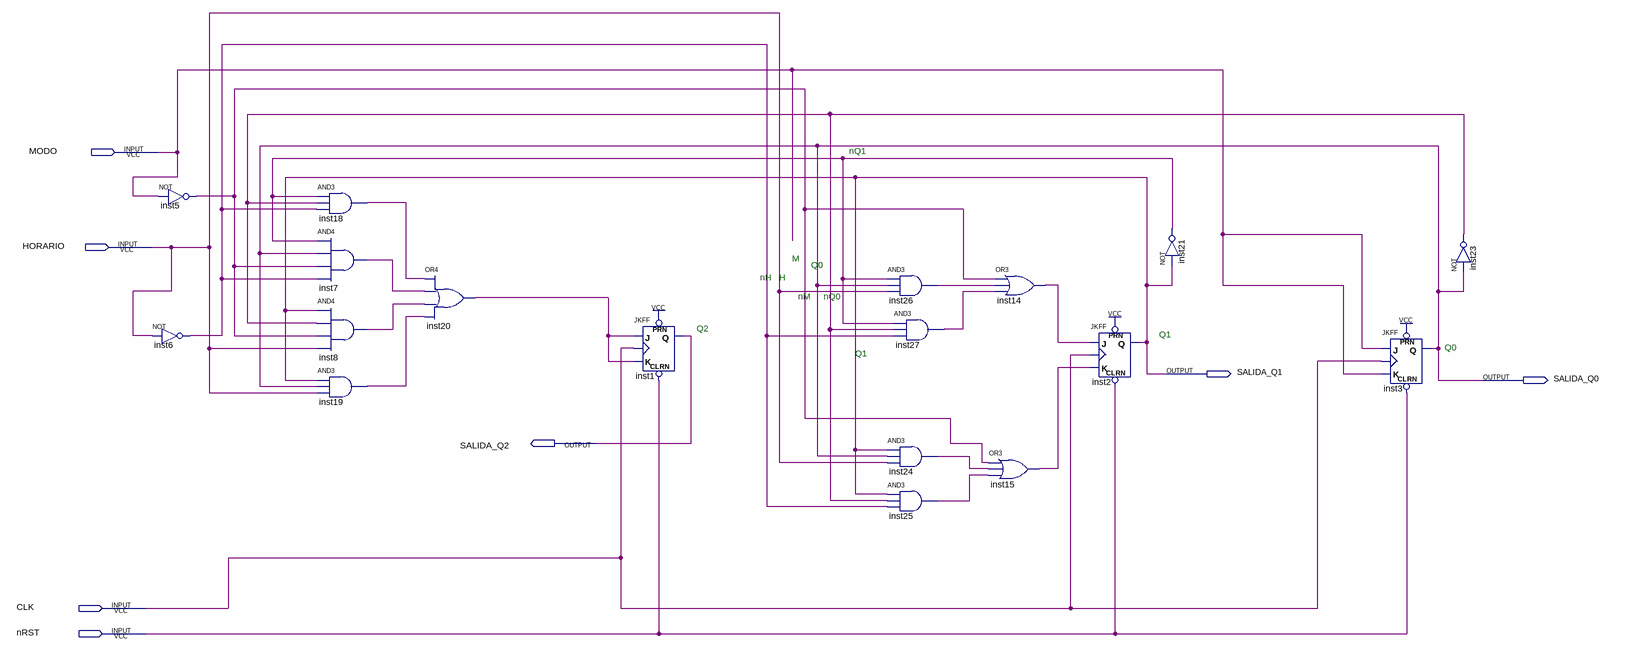
[diagram p0: schematic sheet]
// Quartus schematic CONTROLADOR.bdf as structural Verilog: 18 symbols, 7 pins
module CONTROLADOR (
  input  MODO,
  input  HORARIO,
  input  CLK,
  input  nRST,
  output SALIDA_Q1,
  output SALIDA_Q0,
  output SALIDA_Q2
);

  wire inst5_out, inst6_out, inst7_out, inst8_out, inst14_out, inst15_out, inst18_out, inst19_out,
       inst20_out, inst21_out, inst23_out, inst24_out, inst25_out, inst26_out, inst27_out;

  not inst5 (inst5_out, MODO);
  not inst6 (inst6_out, HORARIO);
  and inst18 (inst18_out, inst21_out, inst23_out, inst6_out);
  and inst7 (inst7_out, inst21_out, SALIDA_Q0, inst5_out, inst6_out);
  and inst8 (inst8_out, SALIDA_Q1, inst23_out, inst5_out, HORARIO);
  and inst19 (inst19_out, SALIDA_Q1, SALIDA_Q0, HORARIO);
  or inst20 (inst20_out, inst18_out, inst7_out, inst8_out, inst19_out);
  JKFF inst1 (.PRN(1'b1), .CLRN(nRST), .K(inst20_out), .J(inst20_out), .CLK(CLK), .Q(SALIDA_Q2));
  and inst26 (inst26_out, inst21_out, SALIDA_Q0, HORARIO);
  and inst27 (inst27_out, inst21_out, inst23_out, inst6_out);
  and inst24 (inst24_out, SALIDA_Q1, SALIDA_Q0, HORARIO);
  and inst25 (inst25_out, SALIDA_Q1, inst23_out, inst6_out);
  or inst14 (inst14_out, inst5_out, inst26_out, inst27_out);
  or inst15 (inst15_out, inst5_out, inst24_out, inst25_out);
  JKFF inst2 (.PRN(1'b1), .CLRN(nRST), .K(inst15_out), .J(inst14_out), .CLK(CLK), .Q(SALIDA_Q1));
  not inst21 (inst21_out, SALIDA_Q1);
  JKFF inst3 (.PRN(1'b1), .CLRN(nRST), .K(MODO), .J(MODO), .CLK(CLK), .Q(SALIDA_Q0));
  not inst23 (inst23_out, SALIDA_Q0);

  // Notes on the sheet:
  //   nQ1
  //   M
  //   Q0
  //   nH
  //   H
  //   nM
  //   nQ0
  //   Q2
  //   Q1
  //   Q0
  //   Q1
endmodule
